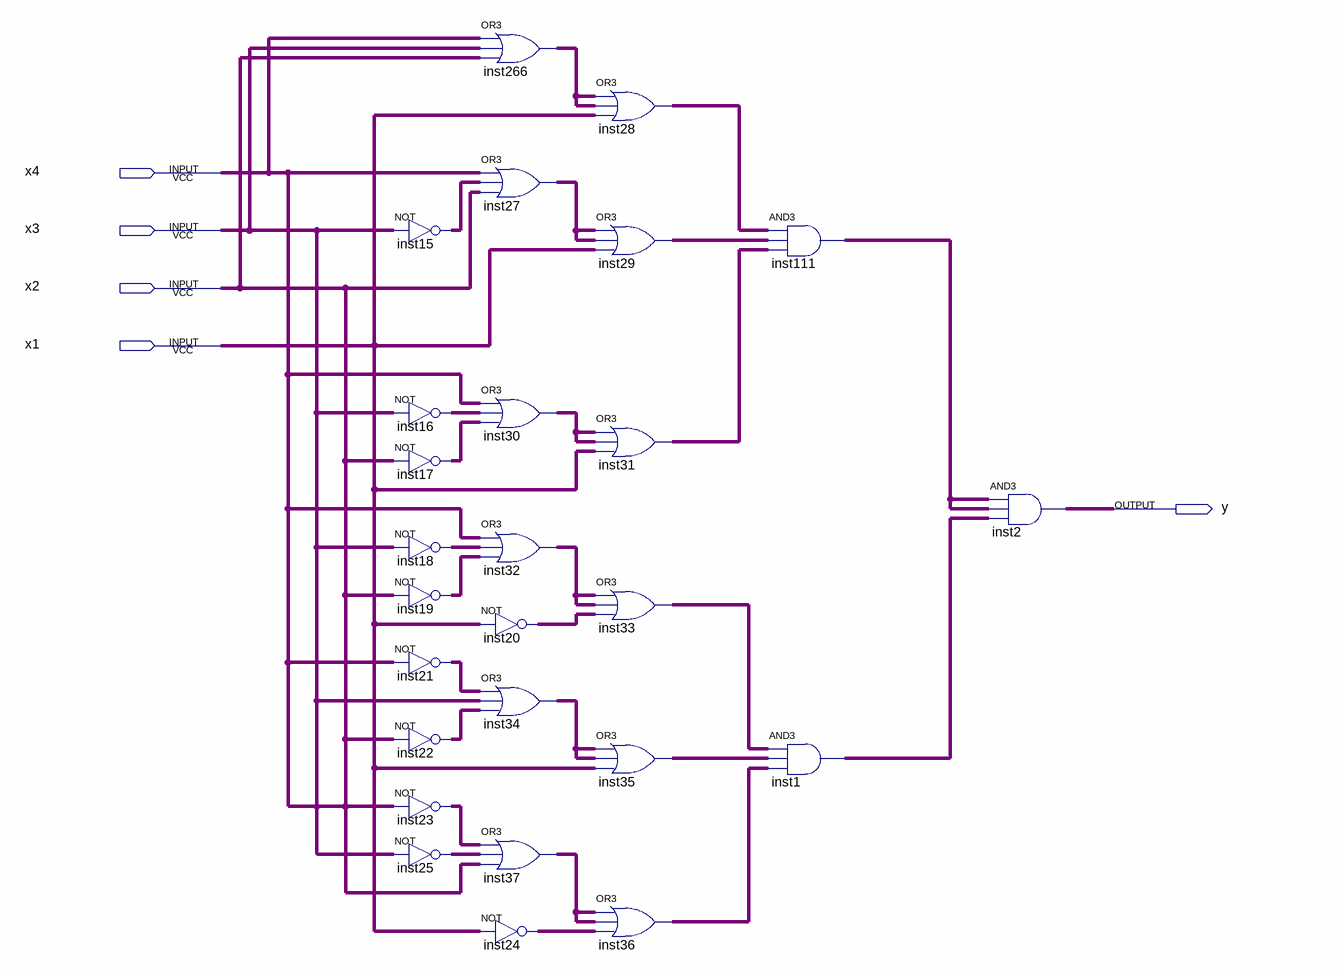
[diagram p0: schematic sheet]
// Quartus schematic LC2.bdf as structural Verilog: 26 symbols, 5 pins
module LC2 (
  input  x4,
  input  x3,
  input  x2,
  input  x1,
  output y
);

  wire inst1_out, inst15_out, inst16_out, inst17_out, inst18_out, inst19_out, inst20_out, inst21_out,
       inst22_out, inst23_out, inst24_out, inst25_out, inst27_out, inst28_out, inst29_out, inst30_out,
       inst31_out, inst32_out, inst33_out, inst34_out, inst35_out, inst36_out, inst37_out, inst111_out,
       inst266_out;

  not inst15 (inst15_out, x2);
  not inst16 (inst16_out, x2);
  not inst17 (inst17_out, x2);
  not inst18 (inst18_out, x2);
  not inst19 (inst19_out, x2);
  not inst21 (inst21_out, x2);
  not inst22 (inst22_out, x2);
  not inst23 (inst23_out, x2);
  not inst25 (inst25_out, x2);
  or inst266 (inst266_out, x2, x2, x2);
  or inst27 (inst27_out, x2, inst15_out, x2);
  or inst30 (inst30_out, x2, inst16_out, inst17_out);
  or inst32 (inst32_out, x2, inst18_out, inst19_out);
  not inst20 (inst20_out, x1);
  or inst34 (inst34_out, inst21_out, x2, inst22_out);
  or inst37 (inst37_out, inst23_out, inst25_out, x2);
  not inst24 (inst24_out, x1);
  or inst28 (inst28_out, inst266_out, inst266_out, x1);
  or inst29 (inst29_out, inst27_out, inst27_out, x1);
  or inst31 (inst31_out, inst30_out, inst30_out, x1);
  or inst33 (inst33_out, inst32_out, inst32_out, inst20_out);
  or inst35 (inst35_out, inst34_out, inst34_out, x1);
  or inst36 (inst36_out, inst37_out, inst37_out, inst24_out);
  and inst111 (inst111_out, inst28_out, inst29_out, inst31_out);
  and inst1 (inst1_out, inst33_out, inst35_out, inst36_out);
  and inst2 (y, inst111_out, inst111_out, inst1_out);

  assign x3 = x2;
  assign x4 = x2;
endmodule
